# EAGLE design riscurino-1.0 (EAGLE 7.7.0)

## Sheet 1 of 2
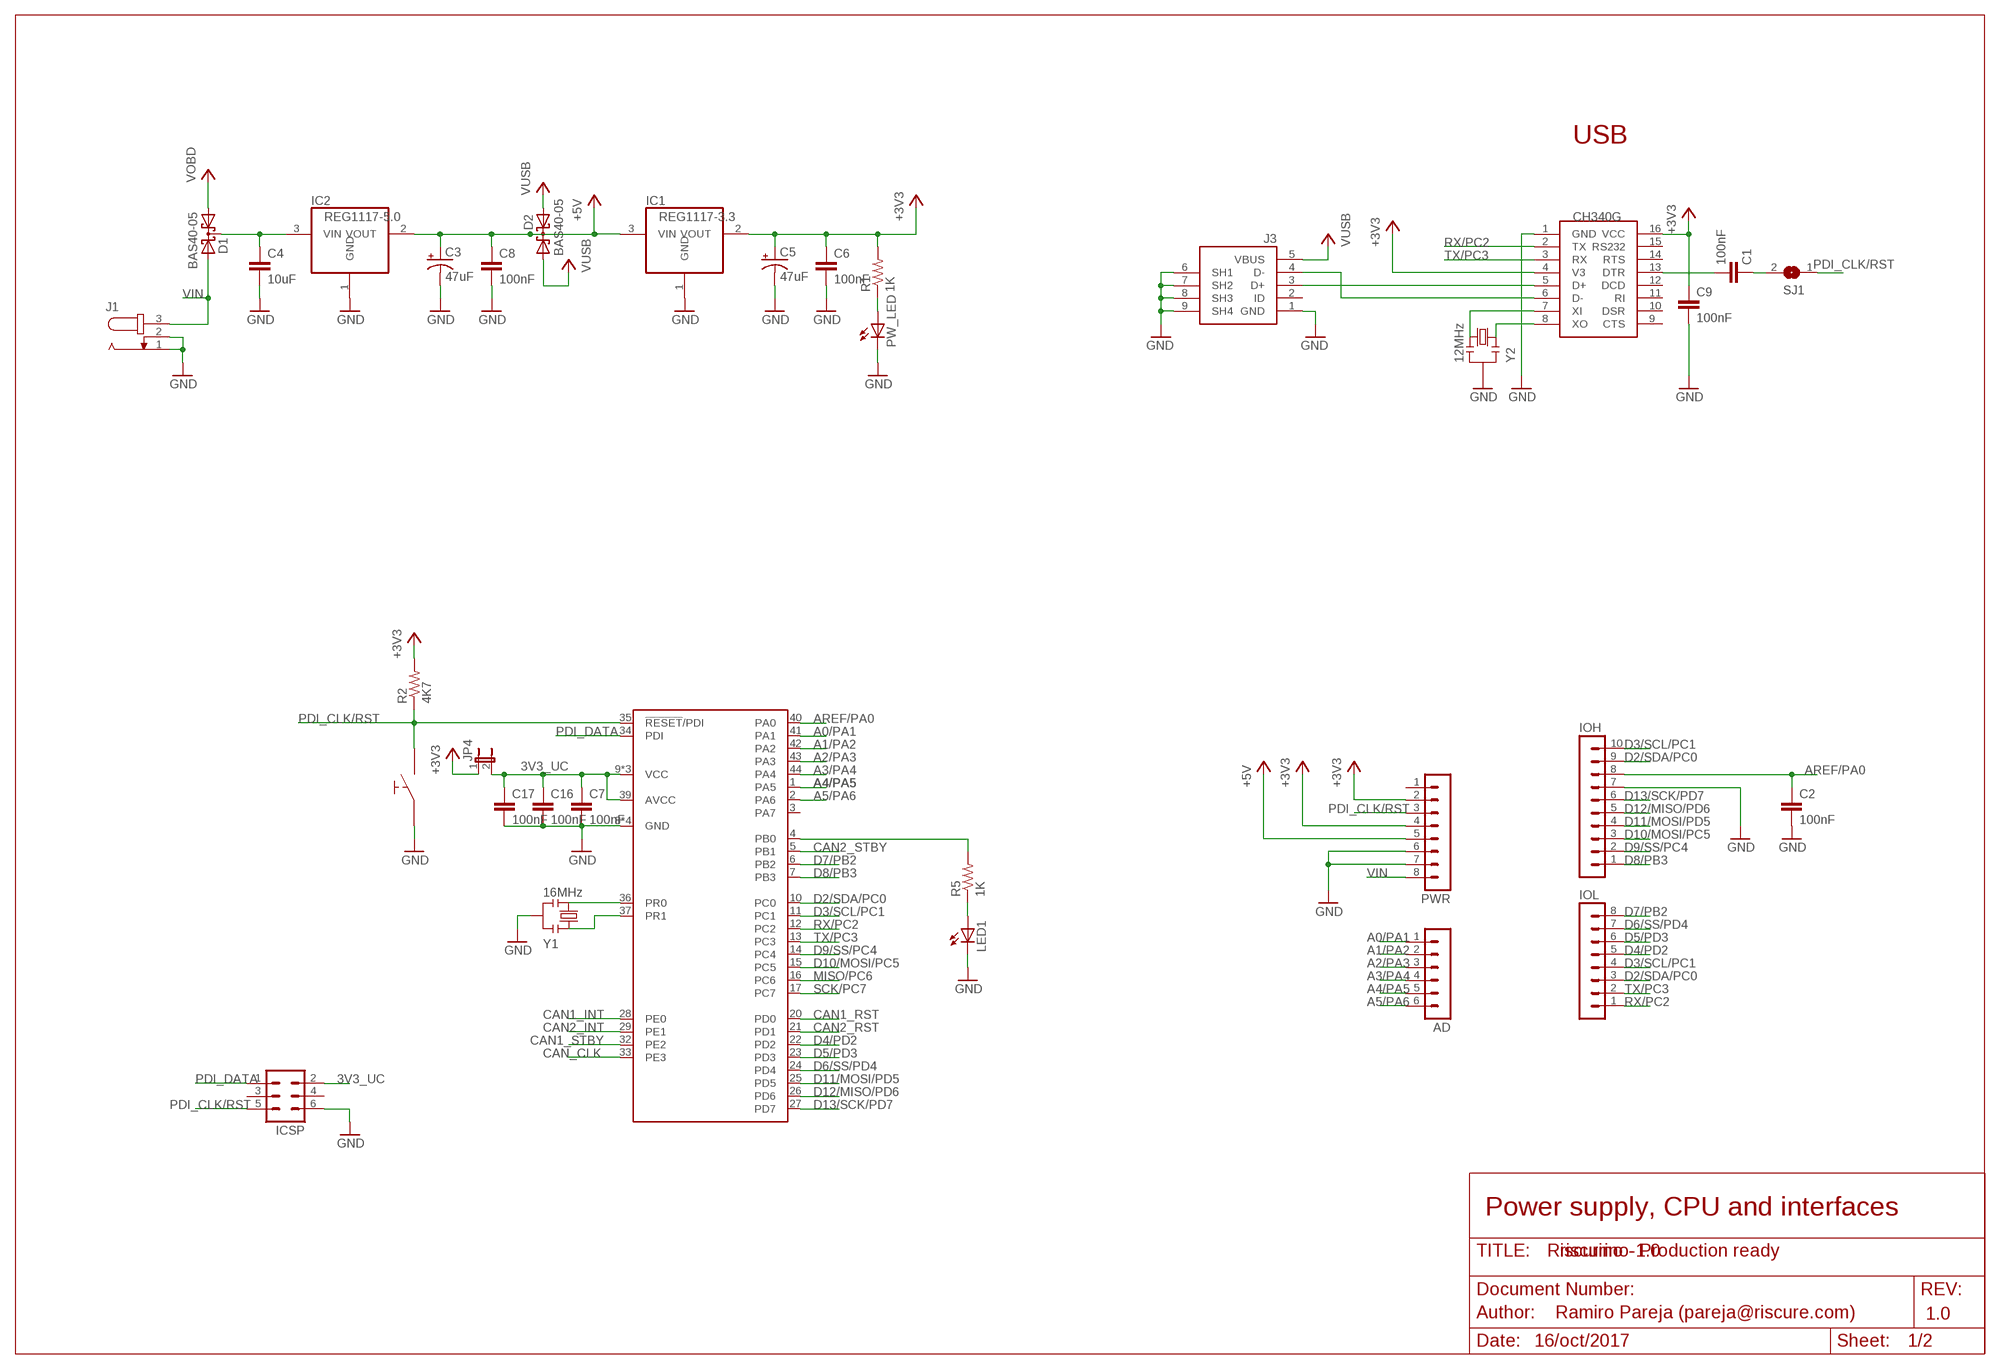
[diagram p0: schematic, sheet 1]

### Parts
AD  MA06-1  [MA06-1]
C1  100nF  C-EUC0805  [C0805]
C2  100nF  C-EUC0805  [C0805]
C3  47uF  CPOL-USC  [PANASONIC_C]
C4  10uF  C-EUC0805  [C0805]
C5  47uF  CPOL-USC  [PANASONIC_C]
C6  100nF  C-EUC0805  [C0805]
C7  100nF  C-EUC0805  [C0805]
C8  100nF  C-EUC0805  [C0805]
C9  100nF  C-EUC0805  [C0805]
C16  100nF  C-EUC0805  [C0805]
C17  100nF  C-EUC0805  [C0805]
D1  BAS40-05  [SOT23]
D2  BAS40-05  [SOT23]
IC1  REG1117-3.3  REG1117  [SOT223]
IC2  REG1117-5.0  REG1117  [SOT223]
ICSP  MA03-2  [MA03-2]
IOH  MA10-1  [MA10-1]
IOL  MA08-1  [MA08-1]
J1  JACK-PLUG0  [SPC4077]
J3  0219_14850  [USB-MINI-B_2]
JP4  JP1E  [JP1]
LED1  LEDCHIPLED_0805  [CHIPLED_0805]
PW_LED  LEDCHIPLED_0805  [CHIPLED_0805]
PWR  MA08-1  [MA08-1]
R1  1K  R-US_R0805  [R0805]
R2  4K7  R-US_R0805  [R0805]
R5  1K  R-US_R0805  [R0805]
SJ1  SJ  [SJ]
U1  ATXMEGA128A4U-AU  [TQFP-44A-44]
U4  CH340G  [SOIC16]
U$1  SWITCH_3X6_BIG  [SWITCH_3X6_BIG]
Y1  16MHz  0011_CSTCE16M0V53-R0  [RESONATOR]
Y2  12MHz  0011_CSTCE16M0V53-R0  [RESONATOR]

### Nets
3V3_UC: C7.1 C16.1 C17.1 ICSP.2 JP4.2 U1.9(VCC) U1.19(VCC) U1.31(VCC) U1.39(AVCC)
+3V3: C5.+ C6.1 C9.1 IC1.2(VOUT) JP4.1 PWR.2 PWR.4 R1.2 R2.2 U4.4(V3) U4.16(VCC) ; also sheet 2
+5V: C3.+ C8.1 D2.3(C) IC1.3(VIN) IC2.2(VOUT) PWR.5 ; also sheet 2
A0/PA1: AD.1 U1.41(PA1)
A1/PA2: AD.2 U1.42(PA2)
A2/PA3: AD.3 U1.43(PA3)
A3/PA4: AD.4 U1.44(PA4)
A4/PA5: AD.5 U1.1(PA5)
A5/PA6: AD.6 U1.2(PA6)
AREF/PA0: C2.1 IOH.8 U1.40(PA0)
CAN1_INT: U1.28(PE0) ; also sheet 2
CAN1_RST: U1.20(PD0) ; also sheet 2
CAN1_STBY: U1.32(PE2) ; also sheet 2
CAN2_INT: U1.29(PE1) ; also sheet 2
CAN2_RST: U1.21(PD1) ; also sheet 2
CAN2_STBY: U1.5(PB1) ; also sheet 2
CAN_CLK: U1.33(PE3) ; also sheet 2
D2/SDA/PC0: IOH.9 IOL.3 U1.10(PC0)
D3/SCL/PC1: IOH.10 IOL.4 U1.11(PC1)
D4/PD2: IOL.5 U1.22(PD2)
D5/PD3: IOL.6 U1.23(PD3)
D6/SS/PD4: IOL.7 U1.24(PD4) ; also sheet 2
D7/PB2: IOL.8 U1.6(PB2)
D8/PB3: IOH.1 U1.7(PB3)
D9/SS/PC4: IOH.2 U1.14(PC4) ; also sheet 2
D10/MOSI/PC5: IOH.3 U1.15(PC5) ; also sheet 2
D11/MOSI/PD5: IOH.4 U1.25(PD5) ; also sheet 2
D12/MISO/PD6: IOH.5 U1.26(PD6) ; also sheet 2
D13/SCK/PD7: IOH.6 U1.27(PD7) ; also sheet 2
GND: C2.2 C3.- C4.2 C5.- C6.2 C7.2 C8.2 C9.2 C16.2 C17.2 IC1.1(GND) IC2.1(GND) ICSP.6 IOH.7 J1.1 J1.2 J3.1(GND) J3.6(SH1) J3.7(SH2) J3.8(SH3) J3.9(SH4) LED1.C PW_LED.C PWR.6 PWR.7 U1.8(GND) U1.18(GND) U1.30(GND) U1.38(GND) U4.1(GND) U$1.P$1 Y1.2 Y2.2 ; also sheet 2
MISO/PC6: U1.16(PC6) ; also sheet 2
N$1: U1.36(PR0) Y1.3
N$2: U1.37(PR1) Y1.1
N$3: C1.2 U4.13(DTR)
N$4: C4.1 D1.3(C) IC2.3(VIN)
N$5: J3.3(D+) U4.5(D+)
N$7: PW_LED.A R1.1
N$8: J3.4(D-) U4.6(D-)
N$11: LED1.A R5.1
N$13: C1.1 SJ1.2
N$14: U4.8(XO) Y2.1
N$15: U4.7(XI) Y2.3
N$18: R5.2 U1.4(PB0)
PDI_CLK/RST: ICSP.5 PWR.3 R2.1 SJ1.1 U1.35(!RESET!/PDI) U$1.P$2
PDI_DATA: ICSP.1 U1.34(PDI)
RX/PC2: IOL.1 U1.12(PC2) U4.2(TX)
SCK/PC7: U1.17(PC7) ; also sheet 2
TX/PC3: IOL.2 U1.13(PC3) U4.3(RX)
VIN: D1.2(A2) J1.3 PWR.8
VOBD: D1.1(A1) ; also sheet 2
VUSB: D2.1(A1) D2.2(A2) J3.5(VBUS)
Unconnected: ICSP.3 ICSP.4 J3.2(ID) PWR.1 U1.3(PA7) U4.9(CTS) U4.10(DSR) U4.11(RI) U4.12(DCD) U4.14(RTS) U4.15(RS232)

### Notes on the sheet
- USB
- Power supply, CPU and interfaces
- Riscurino - Production ready
- Author:    Ramiro Pareja (pareja@riscure.com) | 1.0
- 16/oct/2017

## Sheet 2 of 2
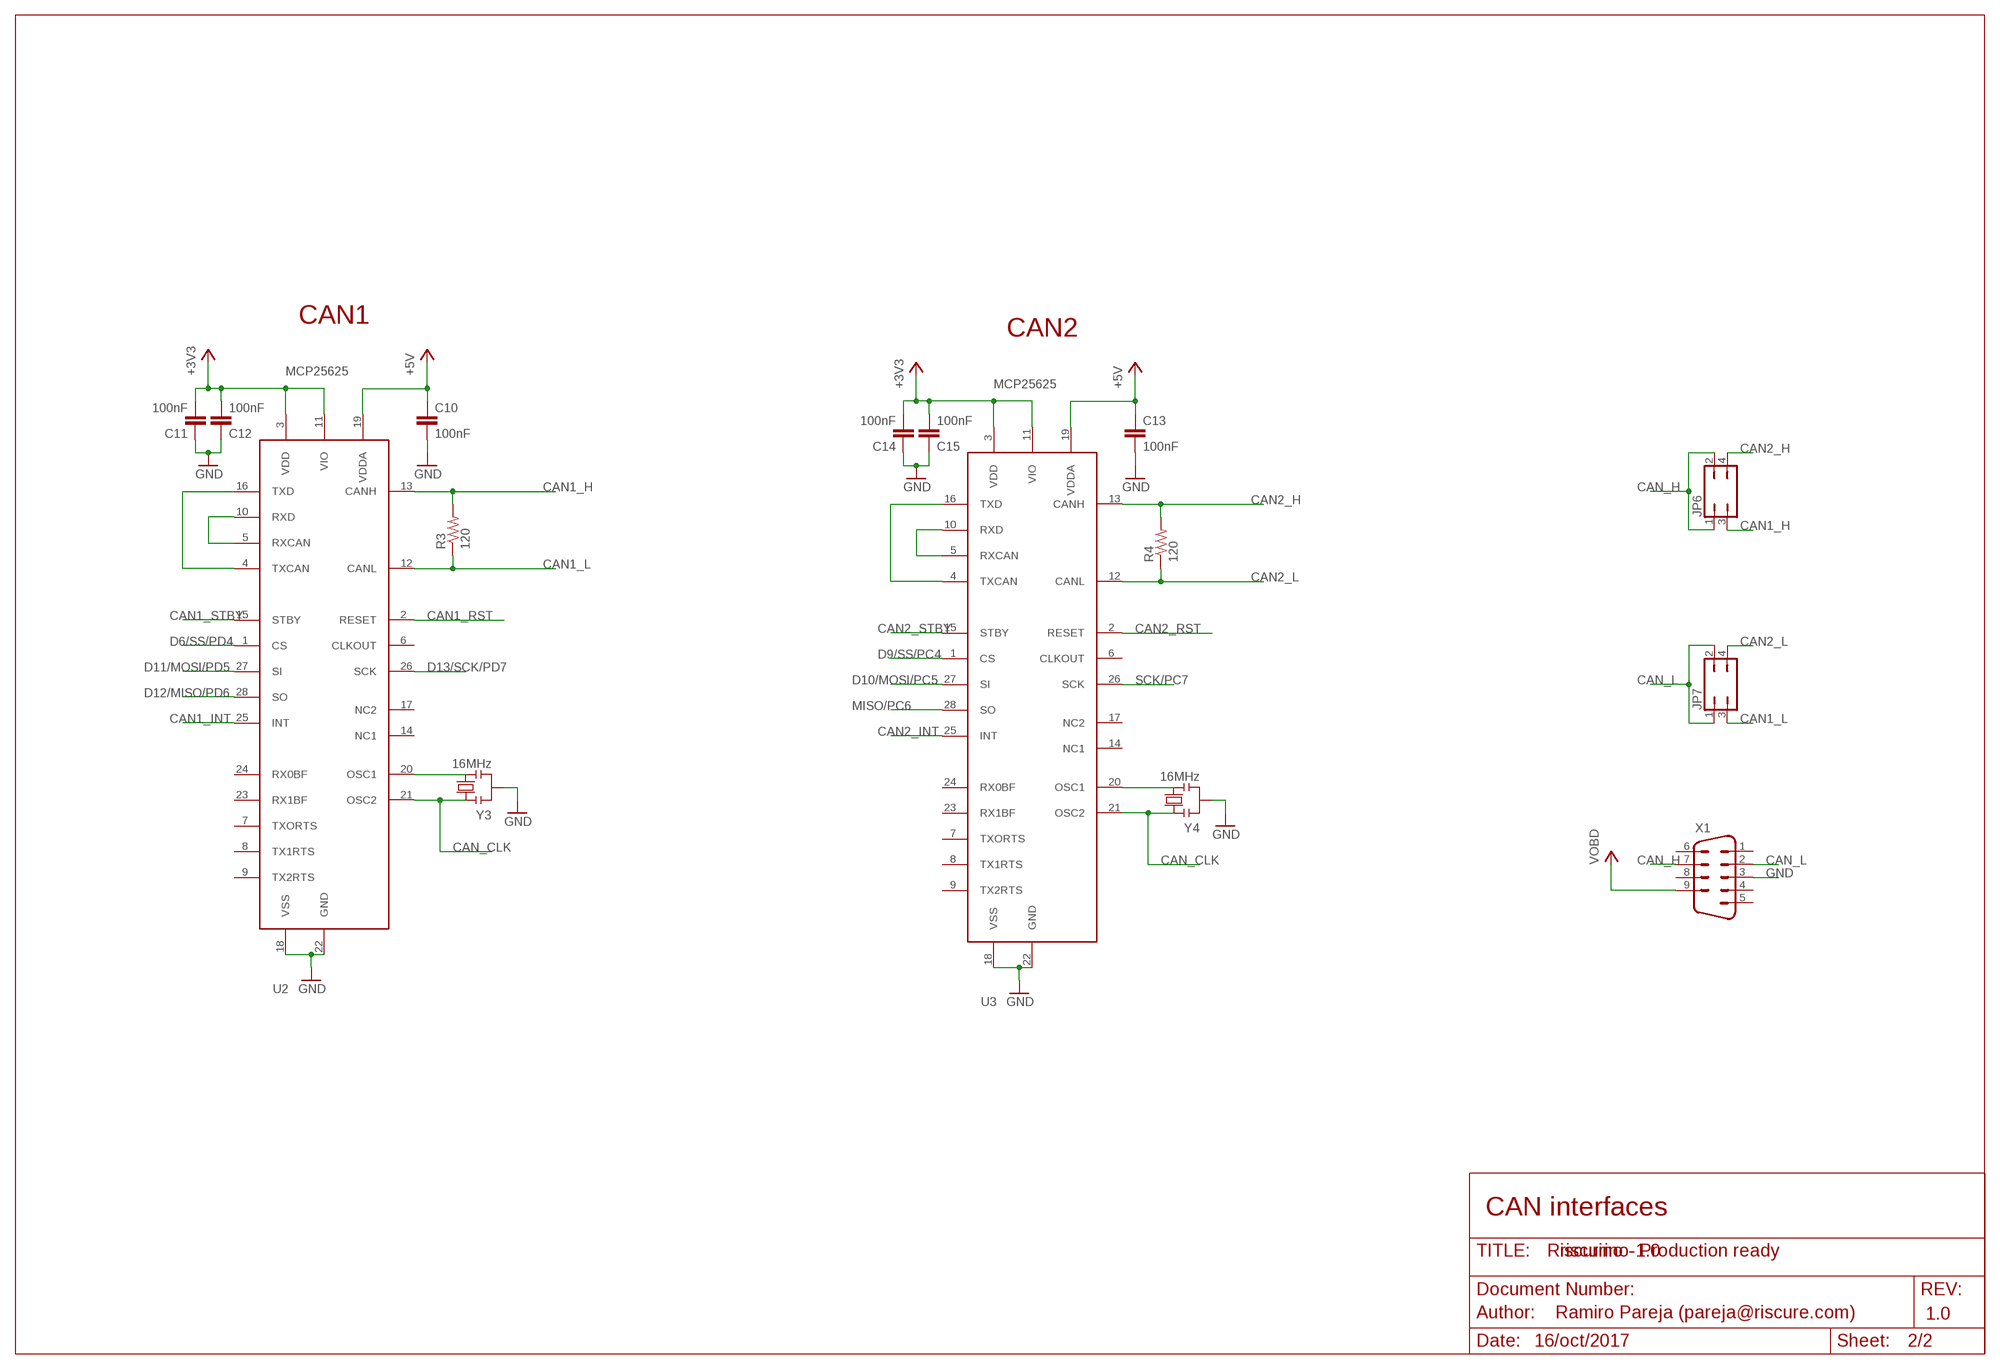
[diagram p1: schematic, sheet 2]

### Parts
C10  100nF  C-EUC0805  [C0805]
C11  100nF  C-EUC0805  [C0805]
C12  100nF  C-EUC0805  [C0805]
C13  100nF  C-EUC0805  [C0805]
C14  100nF  C-EUC0805  [C0805]
C15  100nF  C-EUC0805  [C0805]
JP6  JP2Q  [JP2Q]
JP7  JP2Q  [JP2Q]
R3  120  R-US_R0805  [R0805]
R4  120  R-US_R0805  [R0805]
U2  MCP25625  [QFN28]
U3  MCP25625  [QFN28]
X1  M09HP  [M09HP]
Y3  16MHz  0011_CSTCE16M0V53-R0  [RESONATOR]
Y4  16MHz  0011_CSTCE16M0V53-R0  [RESONATOR]

### Nets
+3V3: C11.2 C12.2 C14.2 C15.2 U2.3(VDD) U2.11(VIO) U3.3(VDD) U3.11(VIO) ; also sheet 1
+5V: C10.1 C13.1 U2.19(VDDA) U3.19(VDDA) ; also sheet 1
CAN1_H: JP6.3 R3.2 U2.13(CANH)
CAN1_INT: U2.25(INT) ; also sheet 1
CAN1_L: JP7.3 R3.1 U2.12(CANL)
CAN1_RST: U2.2(RESET) ; also sheet 1
CAN1_STBY: U2.15(STBY) ; also sheet 1
CAN2_H: JP6.4 R4.2 U3.13(CANH)
CAN2_INT: U3.25(INT) ; also sheet 1
CAN2_L: JP7.4 R4.1 U3.12(CANL)
CAN2_RST: U3.2(RESET) ; also sheet 1
CAN2_STBY: U3.15(STBY) ; also sheet 1
CAN_CLK: U2.21(OSC2) U3.21(OSC2) Y3.1 Y4.1 ; also sheet 1
CAN_H: JP6.1 JP6.2 X1.7
CAN_L: JP7.1 JP7.2 X1.2
D6/SS/PD4: U2.1(CS) ; also sheet 1
D9/SS/PC4: U3.1(CS) ; also sheet 1
D10/MOSI/PC5: U3.27(SI) ; also sheet 1
D11/MOSI/PD5: U2.27(SI) ; also sheet 1
D12/MISO/PD6: U2.28(SO) ; also sheet 1
D13/SCK/PD7: U2.26(SCK) ; also sheet 1
GND: C10.2 C11.1 C12.1 C13.2 C14.1 C15.1 U2.18(VSS) U2.22(GND) U3.18(VSS) U3.22(GND) X1.3 Y3.2 Y4.2 ; also sheet 1
MISO/PC6: U3.28(SO) ; also sheet 1
N$6: U3.4(TXCAN) U3.16(TXD)
N$9: U2.4(TXCAN) U2.16(TXD)
N$10: U2.5(RXCAN) U2.10(RXD)
N$12: U3.5(RXCAN) U3.10(RXD)
N$16: U2.20(OSC1) Y3.3
N$17: U3.20(OSC1) Y4.3
SCK/PC7: U3.26(SCK) ; also sheet 1
VOBD: X1.9 ; also sheet 1
Unconnected: U2.6(CLKOUT) U2.7(TXORTS) U2.8(TX1RTS) U2.9(TX2RTS) U2.14(NC1) U2.17(NC2) U2.23(RX1BF) U2.24(RX0BF) U3.6(CLKOUT) U3.7(TXORTS) U3.8(TX1RTS) U3.9(TX2RTS) U3.14(NC1) U3.17(NC2) U3.23(RX1BF) U3.24(RX0BF) X1.1 X1.4 X1.5 X1.6 X1.8

### Notes on the sheet
- CAN1
- CAN2
- CAN interfaces
- Riscurino - Production ready
- Author:    Ramiro Pareja (pareja@riscure.com) | 1.0
- 16/oct/2017

## Library data of the parts
AD = con-lstb:MA06-1: PIN HEADER; OC_FARNELL: unknown; OC_NEWARK: unknown
C1 C2 C4 C6-C17 = rcl:C-EU: CAPACITOR, European symbol
C3 C5 = rcl:CPOL-US: POLARIZED CAPACITOR, American symbol
D1 D2 = diode:BAS40-05: Silicon Schottky Diodes General-purpose diode for high-speed switching
IC1 IC2 = burr-brown:REG1117: 800mA and 1A Low Dropout (LDO) Positive Regulator 1.8V, 2.5V, 2.85V, 3.3V, 5V, and Adj; MPN: REG1117; OC_FARNELL: 1097566; OC_NEWARK: 14P6981
ICSP = con-lstb:MA03-2: PIN HEADER; OC_FARNELL: unknown; OC_NEWARK: unknown
IOH = con-lstb:MA10-1: PIN HEADER; OC_FARNELL: unknown; OC_NEWARK: unknown
IOL PWR = con-lstb:MA08-1: PIN HEADER; OC_FARNELL: unknown; OC_NEWARK: unknown
J1 = con-jack:JACK-PLUG: DC POWER JACK Power Jack, DC, Right Angle, Through Hole, Rated 5A at 16VDC, PC Terminals Distributor: Farnell (www.Farnell.de) Drawing: 84N1161.pdf / 84N1162.pdf Manufacturer: SPC Technology (www.spctechnology.com) Type: SPC4077 / SPC 4078; OC_FARNELL: unknown; OC_NEWARK: unknown
J3 = Connettori:0219_14850: Usb-Mini F 90 Smd; MONTHLY_USAGE: _____; PART_NUMBER: 14850; PRICE: _____; SUPPLIER: _____; TYPE: Connettori; VALUE: USB-mini-90 -SMD
JP4 = jumper:JP1E: JUMPER
JP6 JP7 = jumper:JP2Q: JUMPER
LED1 PW_LED = led:LED: LED OSRAM: - CHIPLED LG R971, LG N971, LY N971, LG Q971, LY Q971, LO R971, LY R971 LH N974, LH R974 LS Q976, LO Q976, LY Q976 LO Q996 - Hyper CHIPLED LW Q18S LB Q993, LB Q99A, LB R99A - SideLED LS A670, LO A670, LY A670, LG A670, LP A670 LB A673, LV A673, LT A673, LW A673 LH A674 LY A675 LS A676, LA A676, LO A676, LY A676, LW A676 LS A679, LY A679, LG A679 - Hyper Micro SIDELED® LS Y876, LA Y876, LO Y876, LY Y876 LT Y87S - SmartLED LW L88C, LW L88S LB L89C, LB L89S, LG L890 LS L89K, LO L89K, LY L89K LS L896, LA L896, LO L896, LY L896 - TOPLED LS T670, LO T670, LY T670, LG T670, LP T670 LSG T670, LSP T670, LSY T670, LOP T670, LYG T670 LG T671, LOG T671, LSG T671 LB T673, LV T673, LT T673, LW T673 LH T674 LS T676, LA T676, LO T676, LY T676, LB T676, LH T676, LSB T676, LW T676 LB T67C, LV T67C, LT T67C, LS T67K, LO T67K, LY T67K, LW E67C LS E67B, LA E67B, LO E67B, LY E67B, LB E67C, LV E67C, LT E67C LW T67C LS T679, LY T679, LG T679 LS T770, LO T770, LY T770, LG T770, LP T770 LB T773, LV T773, LT T773, LW T773 LH T774 LS E675, LA E675, LY E675, LS T675 LS T776, LA T776, LO T776, LY T776, LB T776 LHGB T686 LT T68C, LB T68C - Hyper Mini TOPLED® LB M676 - Mini TOPLED Santana® LG M470 LS M47K, LO M47K, LY M47K Source: http://www.osram.convergy.de LUXEON: - LUMILED® LXK2-PW12-R00, LXK2-PW12-S00, LXK2-PW14-U00, LXK2-PW14-V00 LXK2-PM12-R00, LXK2-PM12-S00, LXK2-PM14-U00 LXK2-PE12-Q00, LXK2-PE12-R00, LXK2-PE12-S00, LXK2-PE14-T00, LXK2-PE14-U00 LXK2-PB12-K00, LXK2-PB12-L00, LXK2-PB12-M00, LXK2-PB14-N00, LXK2-PB14-P00, LXK2-PB14-Q00 LXK2-PR12-L00, LXK2-PR12-M00, LXK2-PR14-Q00, LXK2-PR14-R00 LXK2-PD12-Q00, LXK2-PD12-R00, LXK2-PD12-S00 LXK2-PH12-R00, LXK2-PH12-S00 LXK2-PL12-P00, LXK2-PL12-Q00, LXK2-PL12-R00 Source: www.luxeon.com KINGBRIGHT: KA-3528ASYC Source: www.kingbright.com
R1-R5 = rcl:R-US_: RESISTOR, American symbol
SJ1 = jumper:SJ: SMD solder JUMPER
U1 = atmel-xmega:ATXMEGA128A4U: 8/16-bit XMEGA A4U Microcontroller Features High-performance, low-power Atmel® AVR® XMEGA® 8/16-bit Microcontroller Nonvolatile program and data memories – 16K - 128KBytes of in-system self-programmable flash – 4K - 8KBytes boot section – 1K - 2KBytes EEPROM – 2K - 8KBytes internal SRAM Peripheral Features – Four-channel DMA controller – Eight-channel event system – Five 16-bit timer/counters Three timer/counters with 4 output compare or input capture channels Two timer/counters with 2 output compare or input capture channels High-resolution extensions on all timer/counters Advanced waveform extension (AWeX) on one timer/counter – One USB device interface USB 2.0 full speed (12Mbps) and low speed (1.5Mbps) device compliant 32 Endpoints with full configuration flexibility – Five USARTs with IrDA support for one USART – Two Two-wire interfaces with dual address match (I2C and SMBus compatible) – Two serial peripheral interfaces (SPIs) – AES and DES crypto engine – CRC-16 (CRC-CCITT) and CRC-32 (IEEE® 802.3) generator – 16-bit real time counter (RTC) with separate oscillator – One twelve-channel, 12-bit, 2mspsAnalog to Digital Converter – One two-channel, 12-bit, 1msps Digital to Analog Converter – Two Analog Comparators with window compare function, and current sources – External interrupts on all general purpose I/O pins – Programmable watchdog timer with separate on-chip ultra low power oscillator – QTouch® library support Capacitive touch buttons, sliders and wheels Special microcontroller features – Power-on reset and programmable brown-out detection – Internal and external clock options with PLL and prescaler – Programmable multilevel interrupt controller – Five sleep modes – Programming and debug interfaces PDI (program and debug interface) I/O and packages – 34 Programmable I/O pins – 44 - lead TQFP – 44 - pad VQFN/QFN – 49 - ball VFBGA Operating voltage – 1.6 – 3.6V Operating frequency – 0 – 12MHz from 1.6V – 0 – 32MHz from 2.7V
U2 U3 = MCP25625-fixed:MCP25625
U4 = ch340g:CH340G
U$1 = riscurino:SWITCH_3X6_BIG
X1 = con-subd:M09: SUB-D; OC_FARNELL: unknown; OC_NEWARK: unknown
Y1-Y4 = Cristalli:0011_CSTCE16M0V53-R0: 16Mhz - SMD; MONTHLY_USAGE: _____; PART_NUMBER: CSTCE16M0V53-R0; PRICE: _____; SUPPLIER: _____; TYPE: Cristalli; VALUE: CSTCE16M0V53-R0

## Board
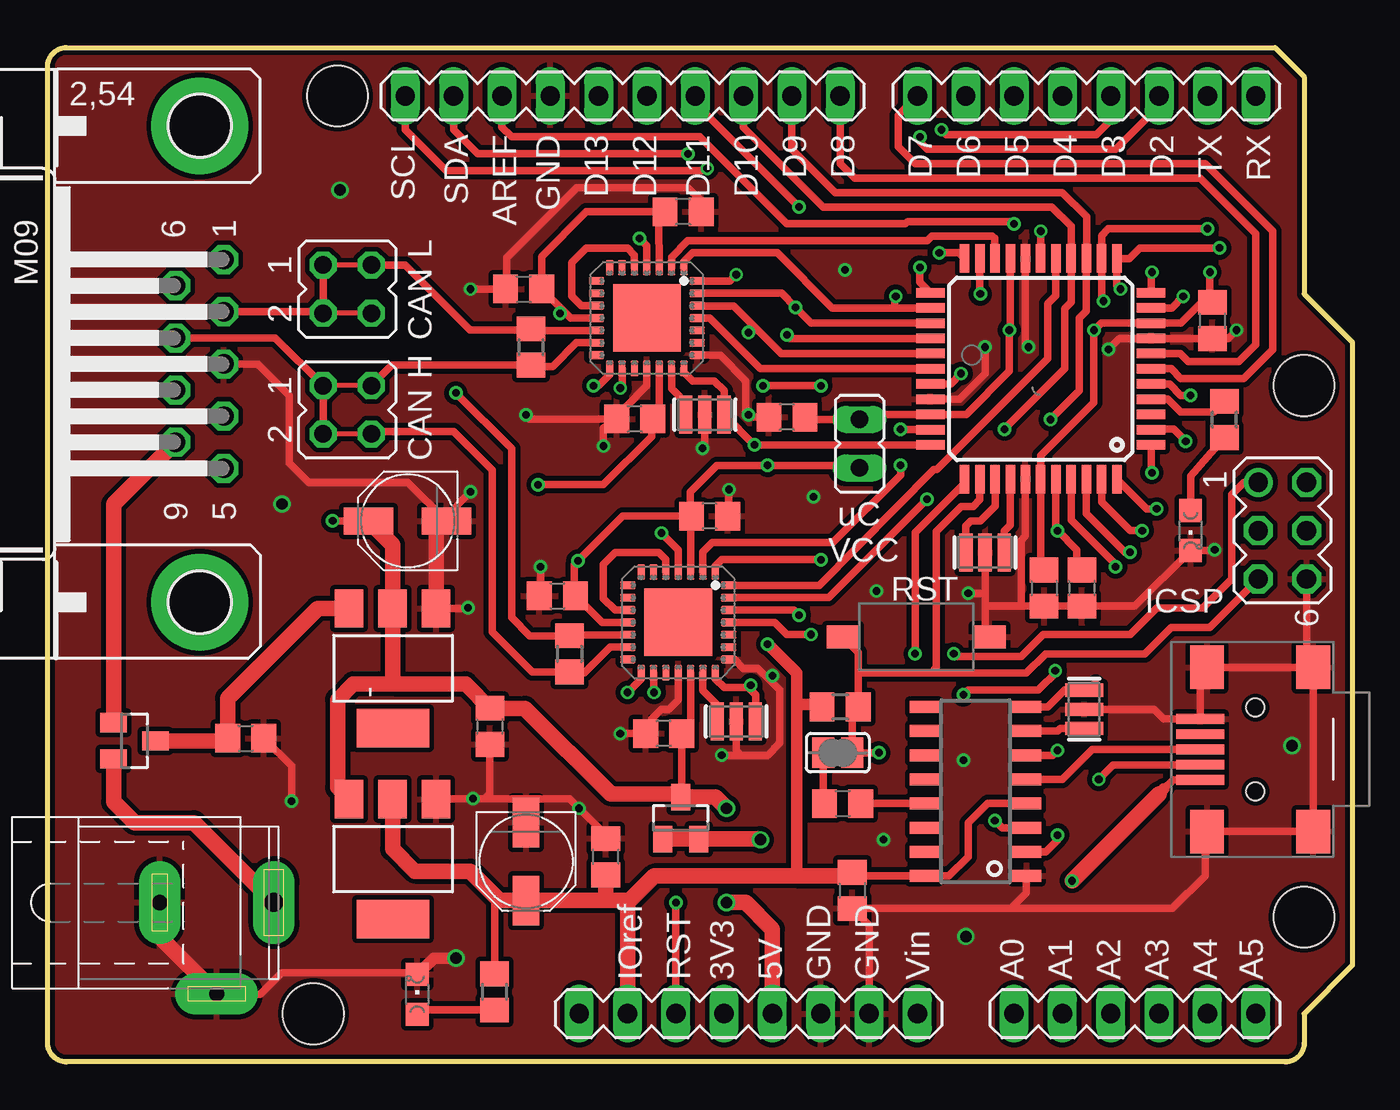
[diagram p2: board, top side]
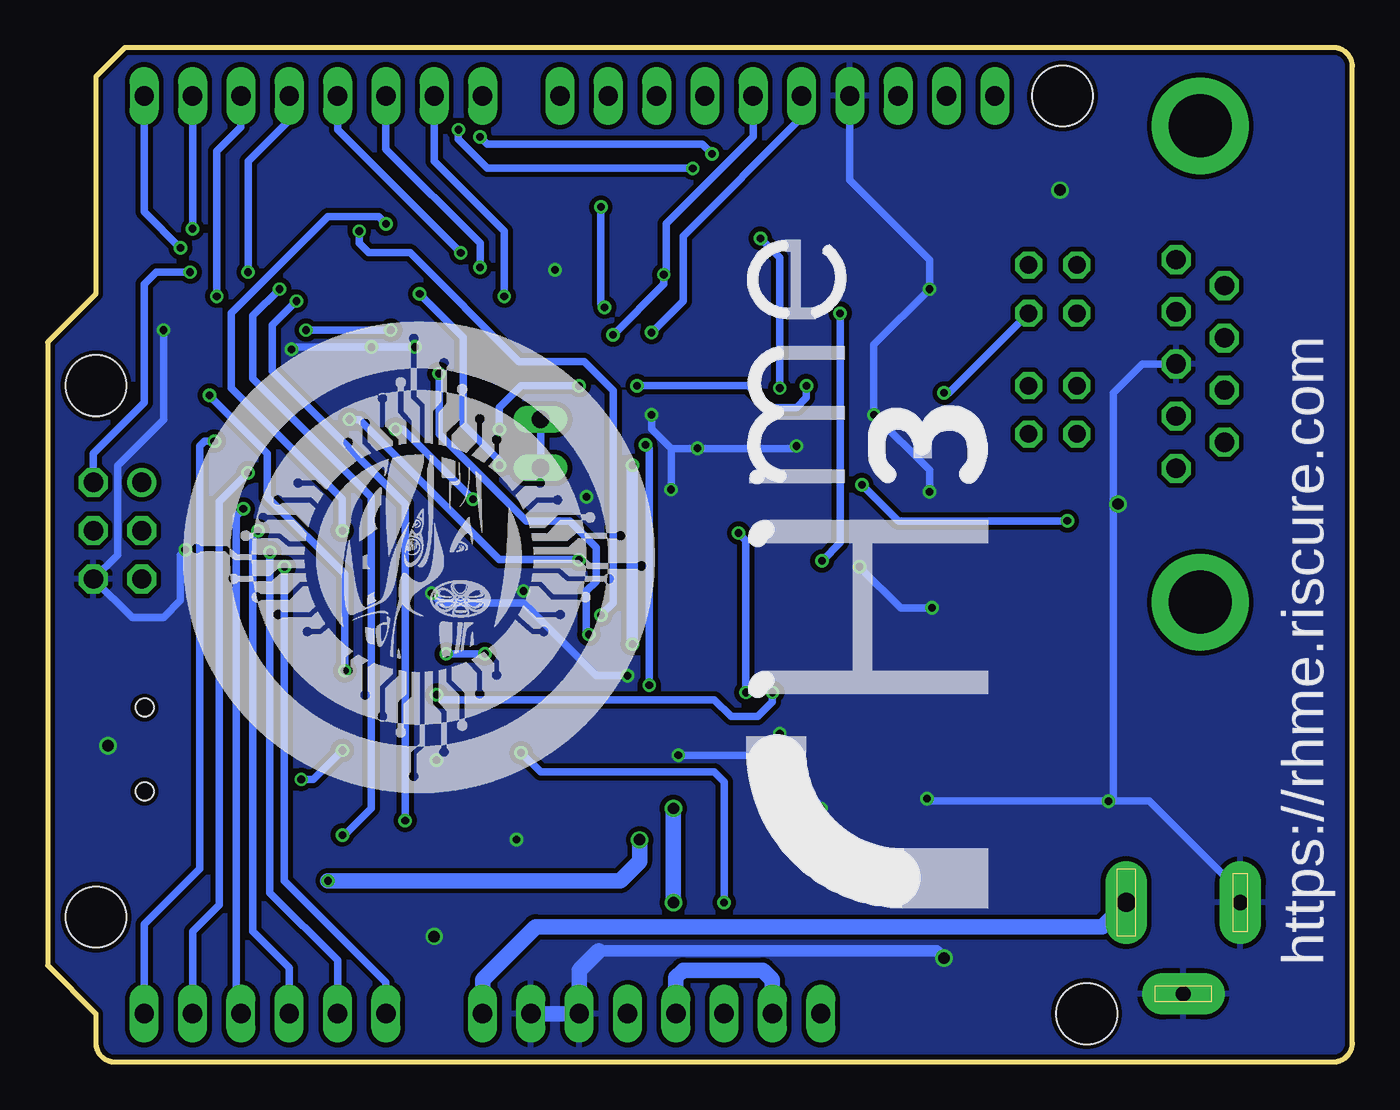
[diagram p3: board, bottom side, seen from below]

Size 68.58 x 53.34 mm. Coordinates in mm from the lower left corner, seen from the top.
Outline: 64.52,53.34 66.04,51.82 66.04,40.39 68.58,37.85 68.58,5.08 66.04,2.54 66.04,1 arc-90 65.04,0 1,0 arc-90 0,1 0,52.34 arc-90 1,53.34 64.52,53.34
Copper layers (1*16): Top 0.035mm / dielectric 1.5mm / Bottom 0.035mm
Design rules "ITEADstudio_DRC *": minimum track width 8mil, minimum drill 0.4mm, track to track 8mil, track to pad 8mil, pad to pad 8mil, via to via 8mil, smd to smd 0mil, copper to edge 10mil, drill to drill 10mil, minimum pad ring 10mil, minimum via ring 6mil, stop-mask expansion 2mil, vias tented up to drill 100mil, thermal gap 10mil
Holes 3.2 mm at 66.04,35.56 66.04,7.62 15.24,50.8 13.97,2.54

### Footprints (pad centres in the part's own frame; a part is rotated, then mirrored left to right if it is on the bottom)
MA06-1 = drill 1.016 long: 1 -6.35,0; 2 -3.81,0; 3 -1.27,0; 4 1.27,0; 5 3.81,0; 6 6.35,0
C0805 = smd 1.3 x 1.5: 1 -0.95,0; 2 0.95,0
PANASONIC_C = smd 2.6 x 1.4: + 2.05,0; - -2.05,0
SOT23 = smd 1 x 1.4: 1 -0.95,-1.1; 2 0.95,-1.1; 3 0,1.1
SOT223 = smd 1.499 x 2.007: 1 -2.261,-3.15; 2 0.025,-3.15; 3 2.311,-3.15 | smd 3.81 x 2.007: 4 0,3.15
MA03-2 = drill 1.016: 1 -2.54,-1.27 | drill 1.016 octagon: 2 -2.54,1.27; 3 0,-1.27; 4 0,1.27; 5 2.54,-1.27; 6 2.54,1.27
MA10-1 = drill 1.016 long: 1 -11.43,0; 2 -8.89,0; 3 -6.35,0; 4 -3.81,0; 5 -1.27,0; 6 1.27,0; 7 3.81,0; 8 6.35,0; 9 8.89,0; 10 11.43,0
MA08-1 = drill 1.016 long: 1 -8.89,0; 2 -6.35,0; 3 -3.81,0; 4 -1.27,0; 5 1.27,0; 6 3.81,0; 7 6.35,0; 8 8.89,0
SPC4077 = drill 0.8 pad 2.184 long: 1 -3,0; 2 0,-4.8 | drill 1 pad 2.184 long: 3 3,0
USB-MINI-B_2 = smd 0.508 x 2.54: 1 0,0; 2 0.8,0; 3 1.6,0; 4 2.4,0; 5 3.2,0 | smd 2.286 x 1.778: 6 -2.717,5.948; 7 -2.717,0.36; 8 5.918,0.36; 9 5.918,5.948 | hole 0.95: -0.6,2.9; 3.8,2.9
JP1 = drill 0.914 long: 1 0,-1.27; 2 0,1.27
JP2Q = drill 0.914 octagon: 1 -1.27,-1.27; 2 1.27,-1.27; 3 -1.27,1.27; 4 1.27,1.27
CHIPLED_0805 = smd 1.2 x 1.2: A 0,-1.05; C 0,1.05
R0805 = smd 1.3 x 1.5: 1 -0.95,0; 2 0.95,0
SJ = smd 1.168 x 1.6: 1 -0.762,0; 2 0.762,0
TQFP-44A-44 = smd 1.5 x 0.5: 1 -5.8,4; 2 -5.8,3.2; 3 -5.8,2.4; 4 -5.8,1.6; 5 -5.8,0.8; 6 -5.8,0; 7 -5.8,-0.8; 8 -5.8,-1.6; 9 -5.8,-2.4; 10 -5.8,-3.2; 11 -5.8,-4; 23 5.8,-4; 24 5.8,-3.2; 25 5.8,-2.4; 26 5.8,-1.6; 27 5.8,-0.8; 28 5.8,0; 29 5.8,0.8; 30 5.8,1.6; 31 5.8,2.4; 32 5.8,3.2; 33 5.8,4 | smd 0.5 x 1.5: 12 -4,-5.8; 13 -3.2,-5.8; 14 -2.4,-5.8; 15 -1.6,-5.8; 16 -0.8,-5.8; 17 0,-5.8; 18 0.8,-5.8; 19 1.6,-5.8; 20 2.4,-5.8; 21 3.2,-5.8; 22 4,-5.8; 34 4,5.8; 35 3.2,5.8; 36 2.4,5.8; 37 1.6,5.8; 38 0.8,5.8; 39 0,5.8; 40 -0.8,5.8; 41 -1.6,5.8; 42 -2.4,5.8; 43 -3.2,5.8; 44 -4,5.8
QFN28 = smd 0.8 x 0.4: 1 -2.65,1.95; 2 -2.65,1.3; 3 -2.65,0.65; 4 -2.65,0; 5 -2.65,-0.65; 6 -2.65,-1.3; 7 -2.65,-1.95; 15 2.65,-1.95; 16 2.65,-1.3; 17 2.65,-0.65; 18 2.65,0; 19 2.65,0.65; 20 2.65,1.3; 21 2.65,1.95 | smd 0.4 x 0.8: 8 -1.95,-2.65; 9 -1.3,-2.65; 10 -0.65,-2.65; 11 0,-2.65; 12 0.65,-2.65; 13 1.3,-2.65; 14 1.95,-2.65; 22 1.95,2.65; 23 1.3,2.65; 24 0.65,2.65; 25 0,2.65; 26 -0.65,2.65; 27 -1.3,2.65; 28 -1.95,2.65 | smd 3.55 x 3.55: M 0,0
SOIC16 = smd 0.635 x 1.524: 1 -4.445,-2.695; 2 -3.175,-2.695; 3 -1.905,-2.695; 4 -0.635,-2.695; 5 0.635,-2.695; 6 1.905,-2.695; 7 3.175,-2.695; 8 4.445,-2.695; 9 4.445,2.695; 10 3.175,2.695; 11 1.905,2.695; 12 0.635,2.695; 13 -0.635,2.695; 14 -1.905,2.695; 15 -3.175,2.695; 16 -4.445,2.695
SWITCH_3X6_BIG = smd 1.7 x 1.2: P$1 -3.91,0; P$2 3.79,0
M09HP = drill 1.016 octagon: 1 -5.486,1.27; 2 -2.743,1.27; 3 0,1.27; 4 2.743,1.27; 5 5.486,1.27; 6 -4.115,-1.27; 7 -1.372,-1.27; 8 1.372,-1.27; 9 4.115,-1.27 | drill 3.302 pad 5.08: G1 -12.522,0; G2 12.522,0
RESONATOR = smd 0.7 x 2: 1 -1,0; 2 0,0; 3 1,0

### Placement (x,y rotation side)
AD  57.15,2.54 0 top
C1  41.78,13.59 0 top
C2  54.36,24.92 270 top
C3  18.92,28.45 180 top
C4  10.41,17.02 0 top
C5  25.15,10.54 270 top
C6  29.34,10.79 90 top
C7  61.21,38.99 270 top
C8  23.24,17.65 270 top
C9  42.29,9.02 270 top
C10  30.86,33.81 180 top
C11  25.02,40.64 0 top
C12  33.4,44.7 180 top
C13  32.38,17.27 180 top
C14  34.8,28.7 180 top
C15  26.8,24.51 0 top
C16  38.86,33.91 180 top
C17  52.37,24.92 270 top
D1  4.57,16.89 270 top
D2  33.27,12.83 0 top
IC1  18.16,10.67 180 top
IC2  18.16,20.7 180 top
ICSP  64.9,27.94 270 top
IOH  30.23,50.8 180 top
IOL  54.61,50.8 180 top
J1  8.89,8.38 0 top
J3  60.58,18.03 270 top
JP4  42.67,32.51 0 top
JP6  15.75,34.29 270 top
JP7  15.75,40.64 270 top
LED1  60.07,27.94 180 top
PW_LED  19.43,3.56 0 top
PWR  36.83,2.54 0 top
R1  23.5,3.68 90 top
R2  41.66,18.67 180 top
R3  25.4,37.59 270 top
R4  27.43,21.46 270 top
R5  61.85,33.78 90 top
SJ1  41.53,16.26 180 top
U1  52.2,36.45 180 top
U2  31.5,39.12 270 top
U3  33.15,23.11 270 top
U4  48.77,14.22 90 top
U$1  45.59,22.35 180 top
X1  8,36.7 270 top
Y1  49.28,26.8 180 top
Y2  54.48,18.54 270 top
Y3  34.54,34.04 180 top
Y4  36.2,17.91 180 top

### Tracks (layer width: path | path; a pad name or v marks a point on that pad's centre or on a via)
3V3_UC  (via drill 0.4)
  Top 0.406: C16.1 39.94,33.78 JP4.2 42.94,34.05 U1.31 48.27,34.05 50.55,36.32 v50.55,38.48 50.6,38.66 U1.19 | C17.1 52.2,26.48 U1.39 52.2,31.88 54.99,34.67 v54.99,38.48 55.38,38.85 U1.9 59.55,38.85 60.58,39.88 61.15,39.88 C7.1 61.09,40.07 v61.09,41.53
  Bottom 0.406: v54.99,38.48 v50.55,38.48 | ICSP.2 66.17,32 63.5,34.67 63.5,40.89 62.87,41.53 v61.09,41.53
+3V3  (via drill 0.4)
  Top 0.406: R1.2 23.5,8.26 23.75,8.51 | C9.1 42.48,9.78 U4.16 47.37,9.78 48.39,10.79 48.39,12.57 49.4,13.59 U4.4 | 28.07,39.12 U2.11 27.49,39.12 27.12,39.49 | U2.3 32.13,44.2 C12.2 28.32,44.7 25.97,42.35 C11.2 27.12,39.49 | U3.11 29.14,23.11 C15.2 27.69,24.57 27.69,26.16 v27.88,26.35 30.23,28.7 C14.2 | U3.3 33.8,28.65 C14.2 | 39.37,9.91 39.5,9.78 | C14.2 33.78,28.77 33.78,29.97 35.18,31.37 v37.85,31.37 42.67,31.37 JP4.1 | 27.12,39.49 27.05,39.49 v26.92,39.37
  Top 0.61: 39.37,9.91 39.37,18.8 | 39.37,18.8 39.37,20.45 v37.85,21.97 | 39.37,18.8 40.58,18.8 R2.2
  Top 0.813: IC1.2 18.14,11.2 19.3,10.03 22.23,10.03 23.75,8.51 25.13,8.51 C5.+ 29.46,8.49 | 29.46,8.49 30.61,8.49 | C9.1 42.1,9.78 39.5,9.78 31.89,9.78 30.61,8.49 | C6.1 29.34,8.62 29.46,8.49 | PWR.2 30.48,8.36 30.61,8.49
  Bottom 0.406: v26.92,39.37 26.92,27.3 v27.88,26.35 | JP4.1 42.67,33.78
  Bottom 0.61: v37.85,21.97 v37.85,31.37
  Bottom 0.813: PWR.4 35.56,4.45 35.18,4.83 30.99,4.83 30.48,4.32 PWR.2
+5V  (via drill 0.4, 0.6)
  Top 0.406: U2.19 32.15,34.57 C10.1 31.75,33.84 31.75,32.89 29.21,30.35 v25.78,30.35 | U3.19 33.8,17.98 C13.1 33.34,13.99 D2.3 | C3.+ v14.99,28.45
  Top 0.813: 18.22,19.88 18.14,19.96 | 18.22,19.88 18.03,19.88 | 18.03,19.88 16.07,19.88 15.24,19.05 15.24,14.43 IC1.3 | 18.22,19.88 21.97,19.88 C8.1 25.09,18.6 29.59,14.1 33.1,14.1 D2.3 35.09,13.93 v35.69,13.34 | C3.+ 18.14,27.18 IC2.2 18.14,19.98 18.03,19.88 | PWR.5 38.1,6.99 36.7,8.38 v35.69,8.38
  Bottom 0.406: v14.99,28.45 23.88,28.45 v25.78,30.35
  Bottom 0.813: v35.69,8.38 v35.69,13.34
A0/PA1  (via drill 0.4)
  Top 0.406: U1.41 53.8,28.5 56.13,26.16 v56.13,26.04
  Bottom 0.406: v56.13,26.04 56.13,9.53 50.8,4.19 AD.1
A1/PA2  (via drill 0.4)
  Top 0.406: U1.42 54.6,28.84 56.64,26.8 v56.9,26.8
  Bottom 0.406: v56.9,26.8 56.9,8.89 53.34,5.33 AD.2
A2/PA3  (via drill 0.4)
  Top 0.406: U1.43 55.4,29.44 56.9,27.94 v57.53,27.94
  Bottom 0.406: v57.53,27.94 57.78,27.69 57.78,6.86 55.88,4.95 AD.3
A3/PA4  (via drill 0.4)
  Top 0.406: U1.44 57.76,29.08 v58.29,29.08
  Bottom 0.406: v58.29,29.08 58.67,28.7 58.67,3.81 58.42,3.56 AD.4
A4/PA5  (via drill 0.4)
  Top 0.406: U1.1 58,31.03 v58.04,30.99
  Bottom 0.406: v58.04,30.99 59.56,29.46 59.56,8.26 60.96,6.86 AD.5
A5/PA6  (via drill 0.4)
  Top 0.406: U1.2 58.02,33.27 59.18,33.27 v59.82,32.64
  Bottom 0.406: AD.6 63.5,7.24 60.58,10.16 60.58,32.38 60.33,32.64 v59.82,32.64
AREF/PA0  (via drill 0.4)
  Top 0.406: U1.40 53,28.03 v53.09,27.94 54.1,26.92 54.1,26.35 C2.1 | IOH.8 23.88,49.15 24.38,48.64 34.29,48.64 38.86,44.07 45.09,44.07 45.21,44.2 50.67,44.2 v50.8,44.07
  Bottom 0.406: v53.09,27.94 53.09,29.59 58.93,35.43 58.93,39.37 53.85,44.45 51.18,44.45 v50.8,44.07
CAN1_H
  Top 0.254: JP6.3 14.48,35.56
  Top 0.406: U2.13 27.78,37.82 26.54,36.58 25.85,36.58 R3.2 | 25.71,36.58 R3.2 | JP6.3 18.1,36.64 R3.2
CAN1_INT
  Top 0.406: U2.25 34.8,39.12 37.47,36.45 U1.28
CAN1_L
  Top 0.254: JP7.3 14.48,41.91
  Top 0.406: U2.12 25.86,38.47 R3.1 25.72,38.48 22.23,38.48 18.8,41.91 JP7.3
CAN1_RST
  Top 0.406: U2.2 32.8,42.32 33.66,43.18 46.23,43.18 46.48,43.43 49.66,43.43 49.78,43.31 49.78,42.26 U1.20
CAN1_STBY  (via drill 0.4)
  Top 0.406: U2.15 29.55,36.15 28.96,35.56 v28.7,35.56 | U1.32 44.86,33.25 v44.83,33.27 | v40.64,35.56 v37.59,35.56
  Bottom 0.406: v44.83,33.27 44.83,34.42 43.69,35.56 v40.64,35.56 | v28.7,35.56 28.7,34.92 29.21,34.42 30.61,34.42 31.75,35.56 v37.59,35.56
CAN2_H
  Top 0.254: JP6.4 14.48,33.02
  Top 0.406: U3.13 29.56,21.81 28.19,20.45 27.5,20.45 R4.2 25.46,20.51 23.37,22.61 23.37,31.11 21.34,33.15 17.14,33.15 JP6.4
CAN2_INT  (via drill 0.4)
  Top 0.406: U3.25 38.23,23.11 38.86,22.48 v40.13,22.48 | U1.29 47.46,35.65 v48.01,36.2
  Bottom 0.406: v40.13,22.48 40.26,22.61 40.26,24.77 39.75,25.27 39.75,27.05 41.15,28.45 43.43,28.45 48.01,33.02 v48.01,36.2
CAN2_L  (via drill 0.4)
  Top 0.254: JP7.4 14.48,39.37
  Top 0.406: U3.12 27.48,22.46 R4.1 25.34,22.41 24.38,23.37 24.38,32.26 v21.46,35.18
  Bottom 0.406: v21.46,35.18 21.21,35.18 JP7.4
CAN2_RST  (via drill 0.4)
  Top 0.406: U3.2 34.45,26.83 34.92,27.3 41.27,27.3 44.83,30.86 v44.83,31.37 | U1.21 49,40.41 v49.02,40.39
  Bottom 0.406: v49.02,40.39 46.74,38.1 46.74,33.53 44.83,31.62 v44.83,31.37
CAN2_STBY  (via drill 0.4)
  Top 0.406: U3.15 31.2,20.15 v30.48,19.43 | v48.13,19.3 48.39,19.56 52.07,19.56 53.09,20.57 v52.96,20.57 | U1.5 58.97,35.65 59.56,35.05 v60.07,35.05
  Bottom 0.406: v30.48,19.43 30.48,18.92 31.24,18.16 32.64,18.16 33.53,19.05 47.88,19.05 v48.13,19.3 | v52.96,20.57 52.96,25.65 57.02,29.72 57.02,32 v60.07,35.05
CAN_CLK  (via drill 0.4)
  Top 0.406: U2.21 33.45,36.28 33.91,35.81 35.05,35.81 35.56,35.31 35.56,34.05 Y3.1 35.56,34.04 v37.15,32.45 U1.33 | U3.21 35.1,20.15 35.56,19.68 36.83,19.68 36.96,19.56 | 36.96,19.56 37.21,19.3 37.21,18.3 Y4.1 | 36.96,19.56 v36.96,19.81
  Bottom 0.406: v36.96,19.81 36.96,32.26 v37.15,32.45
CAN_H
  Top 0.406: X1.7 11.96,38.08 JP6.1 JP6.2
CAN_L
  Top 0.406: X1.2 14.4,39.45 JP7.2 JP7.1
D2/SDA/PC0  (via drill 0.4)
  Top 0.406: U1.10 59.08,39.65 v59.69,40.26 | IOH.9 21.34,49.02 22.61,47.75 v33.66,47.75 | v45.85,48.64 45.85,48.39 46.23,48.01 56.13,48.01 58.42,50.29 IOL.3
  Bottom 0.406: v59.69,40.26 59.69,47.88 58.42,49.15 IOL.3 | v33.66,47.75 34.16,48.26 45.47,48.26 v45.85,48.64
D3/SCL/PC1  (via drill 0.4)
  Top 0.406: U1.11 58,41.49 v58.04,41.53 | IOH.10 18.8,49.02 20.95,46.86 34.67,46.86 v34.67,46.99 | IOL.4 55.88,49.53 55.12,48.77 47.24,48.77 v46.99,49.02
  Bottom 0.406: v58.04,41.53 58.04,47.37 55.88,49.53 IOL.4 | v34.67,46.99 45.47,46.99 46.74,48.26 46.86,48.39 46.99,48.51 v46.99,49.02
D4/PD2  (via drill 0.4)
  Top 0.406: v46.86,42.55 47.9,42.55 U1.22
  Bottom 0.406: IOL.5 53.34,49.02 v46.86,42.55
D5/PD3  (via drill 0.4)
  Top 0.406: v45.85,41.78 45.85,41 U1.23
  Bottom 0.406: IOL.6 50.8,48.01 45.85,43.05 v45.85,41.78
D6/SS/PD4  (via drill 0.4)
  Top 0.406: U2.1 33.45,42.08 33.91,42.55 38.35,42.55 41.25,39.65 44.52,39.65 | U1.24 44.52,39.65 | 44.52,39.65 44.52,40.2 v44.58,40.26
  Bottom 0.406: IOL.7 48.26,47.37 44.58,43.69 v44.58,40.26
D7/PB2
  Top 0.406: U1.6 59.05,36.45 59.56,35.94 62.87,35.94 64.39,37.47 64.39,43.69 60.83,47.24 45.59,47.24 44.7,48.13 44.7,49.78 IOL.8
D8/PB3
  Top 0.406: IOH.1 41.66,47.24 42.42,46.48 60.58,46.48 63.5,43.56 63.5,37.72 62.61,36.83 59.94,36.83 59.52,37.25 U1.7
D9/SS/PC4  (via drill 0.4)
  Top 0.406: U3.1 35.1,26.08 35.43,26.42 v40.64,26.42 | v52.7,33.78 54.23,35.31 54.23,39.12 54.6,39.48 U1.14 54.61,42.26 54.61,44.45 53.34,45.72 41.4,45.72 39.12,48.01 IOH.2
  Bottom 0.406: v40.64,26.42 44.83,26.42 52.2,33.78 v52.7,33.78
D10/MOSI/PC5  (via drill 0.4)
  Top 0.406: v46.23,29.59 41.05,24.41 U3.27 | v50.29,33.27 53.47,36.45 53.47,39.62 53.8,39.95 U1.15 53.8,43.94 52.78,44.96 40.77,44.96 36.58,49.15 IOH.3
  Bottom 0.406: v50.29,33.27 49.91,33.27 v46.23,29.59
D11/MOSI/PD5  (via drill 0.4)
  Top 0.406: U1.25 40.15,38.85 v39.31,39.69 38.58,40.42 U2.27 | IOH.4 34.04,50.42 v39.5,44.96
  Bottom 0.406: v39.5,44.96 39.5,39.88 v39.31,39.69
D12/MISO/PD6  (via drill 0.4)
  Top 0.406: U2.28 35.86,41.07 v36.2,41.4 | U1.26 39.04,38.05 v38.86,38.23
  Bottom 0.406: v38.86,38.23 36.2,40.89 v36.2,41.4 36.07,41.53 36.07,44.07 31.5,48.64 IOH.5
D13/SCK/PD7  (via drill 0.4)
  Top 0.406: U1.27 38.57,37.25 37.34,38.48 | 37.34,38.48 36.07,39.75 34.16,39.75 U2.26 | 37.34,38.48 36.96,38.48 v36.83,38.35
  Bottom 0.406: IOH.6 28.96,49.66 35.18,43.43 35.18,40.01 v36.83,38.35
GND  (via drill 0.4, 0.6)
  Top 0.406: U3.18 33.15,19.05 32.64,18.54 32.26,18.54 31.75,18.03 31.75,17.59 C13.2 v30.1,17.27 | Y3.2 34.54,32.38 v34.42,32.26 | v29.21,32.38 29.21,33.34 C10.2 | C16.2 36.96,33.91 v36.83,34.04 36.7,34.16 36.7,35.81 35.35,37.17 U2.22 | v35.81,30.1 35.81,28.77 C14.1 | U2.18 31.5,35.56 30.35,34.42 30.35,34.35 C10.2 | C12.1 34.35,45.28 33.66,45.97 27.81,45.97 24.13,42.29 24.13,40.7 C11.1 v22.23,40.64 | U3.22 36.11,21.16 36.58,20.7 37.34,20.7 37.97,20.07 | 37.97,20.07 38.48,19.56 38.48,16.76 37.85,16.13 36.45,16.13 | 36.45,16.13 36.2,16.38 36.2,17.78 | 36.45,16.13 v35.43,16.13 | U$1.P$1 49.28,22.86 49.28,23.97 | 49.28,23.97 49.28,24.64 | 49.28,24.64 Y1.2 | U1.18 51.4,37.76 v51.56,37.59 | U1.30 47.93,34.85 49.28,36.2 v49.28,37.59 | v55.75,37.47 56.34,38.05 U1.8 C7.2 62.04,38.04 v62.48,38.48 | ICSP.6 66.17,21.11 J3.6 | J3.6 J3.7 60.58,20.39 J3.1 58.67,18.03 58.17,18.54 Y2.2 | 52.58,24.32 C17.2 | U1.38 51.4,27.65 51.18,27.43 51.18,24.13 51.24,23.97 | C17.2 C2.2 57.15,23.97 LED1.C 61.31,26.89 v61.34,26.92 | C17.2 51.24,23.97 | 51.24,23.97 49.28,23.97 | J3.6 J3.9 J3.8 60.83,12.01 60.83,9.78 59.12,8.07 50.61,8.07 | 50.61,8.07 C9.2 43.18,7.18 PWR.7 | 50.61,8.07 51.44,8.89 51.44,9.75 U4.1 | 19.34,4.7 12.32,4.7 11.18,3.56 8.92,3.56 J1.2 | X1.3 11.05,36.7 12.7,35.05 12.7,31.5 13.72,30.48 18.94,30.48 C3.- 20.97,28.72 v22.23,29.97 | IC2.1 22.07,23.85 v22.1,23.88 | 25.91,24.57 v25.91,26.04 | C10.2 25.32,33.81 v25.15,34.04 | 20.45,13.84 v22.35,13.84 22.99,13.84 | 22.99,13.84 25.27,13.84 | 25.27,13.84 27.43,13.84 v27.94,13.34 29.34,11.94 C6.2 | C5.- 25.15,13.72 25.27,13.84 | C8.2 23.24,14.1 22.99,13.84 | 37.97,20.07 37.97,20.19 v38.1,20.32
  Top 0.406: 49.28,24.64 v48.39,24.64 | v12.83,13.72 12.83,15.55 C4.2
  Top 0.61: v21.46,5.46 20.29,5.46 PW_LED.C
  Top 0.813: J1.1 5.89,6.58 J1.2 | IC2.1 20.42,27.9 C3.-
  Bottom 0.406: v29.21,32.38 29.34,32.26 v34.42,32.26 35.81,32.26 | v36.83,34.04 36.83,33.27 35.81,32.26 | 35.81,32.26 v35.81,30.1 | IOH.7 26.42,46.35 22.23,42.16 v22.23,40.64 25.15,37.72 v25.15,34.04 22.23,31.11 v22.23,29.97 | v35.43,16.13 31.24,16.13 v30.1,17.27 30.1,15.62 27.94,13.46 v27.94,13.34 | v49.28,37.59 v51.56,37.59 55.63,37.59 v55.75,37.47 | v62.48,38.48 62.48,33.78 64.9,31.37 64.9,26.67 ICSP.6 64.14,23.37 62.48,23.37 61.59,24.26 61.59,26.67 v61.34,26.92 | J1.1 5.89,8.94 10.67,13.72 v12.83,13.72 | v12.83,13.72 22.23,13.72 v22.35,13.84 | v12.83,13.72 12.57,13.97 12.57,35.18 11.05,36.7 X1.3 | v22.1,23.88 23.75,23.88 v25.91,26.04 | v38.1,20.32 39.75,20.32 43.56,24.13 47.88,24.13 v48.39,24.64
  Bottom 0.61: 39.62,5.84 21.84,5.84 v21.46,5.46
  Bottom 0.813: PWR.7 PWR.6 40.64,4.83 39.62,5.84
  other vias: 15.37,45.85 12.32,29.34 48.26,6.6 65.41,16.64 41.91,41.66 40.26,29.72 43.56,24.77 48.13,15.88 43.94,11.68
  pour Top (isolate 0.254): 0,0 0,53.34 67.69,53.34 68.45,53.34 68.45,1.27 68.45,0
  pour Bottom (isolate 0.254): 0,0 0,53.34 67.69,53.34 68.45,53.34 68.45,1.27 68.45,0
MISO/PC6
  Top 0.406: U3.28 40.56,25.06 46.58,31.14 46.63,31.14 46.74,31.14 52.58,36.98 52.58,37.08 52.58,39.88 53,40.3 U1.16
N$1
  Top 0.406: U1.36 49.8,29.22 49.02,28.45 48.51,28.45 48.26,28.19 48.26,26.81 Y1.3
N$2
  Top 0.406: U1.37 50.6,28.25 50.28,27.92 Y1.1
N$3
  Top 0.406: U4.13 C1.2
N$4
  Top 0.813: IC2.3 14.2,23.85 9.46,19.12 C4.1 9.34,16.89 D1.3
N$5
  Top 0.406: J3.3 54.91,16.43 53.34,14.86 U4.5
N$6  (via drill 0.4)
  Top 0.406: U3.16 31.85,19.46 v31.88,19.43 | U3.4 33.15,26.92 v32.26,27.81
  Bottom 0.406: v31.88,19.43 31.88,27.43 v32.26,27.81
N$7
  Top 0.406: R1.1 19.66,2.73 PW_LED.A
N$8  (via drill 0.4)
  Top 0.406: J3.4 60.57,15.62 56.01,15.62 v55.24,14.86 | U4.6 52.83,16.13 v53.09,16.38
  Bottom 0.406: v55.24,14.86 54.61,14.86 v53.09,16.38
N$9  (via drill 0.4)
  Top 0.406: U2.4 31.5,42.93 v31.11,43.31 | U2.16 30.2,35.4 v30.1,35.43
  Bottom 0.406: v31.11,43.31 30.1,42.29 v30.1,35.43
N$10
  Top 0.406: U2.10 28.05,39.77 27.56,40.26 27.56,42.04 28.32,42.8 30.48,42.8 30.85,42.43 U2.5
N$11
  Top 0.406: LED1.A 60.07,30.8 R5.1
N$12
  Top 0.406: U3.5 32.5,26.43 32.13,26.8 29.84,26.8 29.21,26.16 29.21,24.38 29.83,23.76 U3.10
N$13
  Top 0.406: SJ1.2 40.77,13.65 C1.1
N$14
  Top 0.406: 55.1,19.94 Y2.1 54.47,19.56 53.47,19.56 52.58,18.67 U4.8
N$15
  Top 0.406: U4.7 53.09,17.4 53.21,17.53 54.47,17.53 Y2.3
N$16
  Top 0.406: U2.20 32.8,35.4 33.66,34.54 33.66,34.15 Y3.3
N$17
  Top 0.406: U3.20 34.45,19.53 35.31,18.67 35.31,18.4 Y4.3
N$18
  Top 0.406: 61.71,34.85 R5.2 61.28,34.16 59.56,34.16 58.88,34.85 U1.4
PDI_CLK/RST  (via drill 0.4)
  Top 0.406: PWR.3 v33.02,8.38 | v43.69,16.26 SJ1.1 42.29,18.35 R2.1 42.61,20.44 | 42.61,20.44 42.61,21.52 U$1.P$2 41.78,22.36 | U1.35 49,29.57 48.64,29.21 48.03,29.21 46.71,27.89 46.71,20.77 46.48,20.44 | 42.61,20.44 46.48,20.44 | 46.48,20.44 51.43,20.44 52.45,21.46 57.66,21.46 59.05,22.86 61.09,22.86 ICSP.5
  Bottom 0.406: v33.02,8.38 33.02,14.73 33.53,15.24 42.67,15.24 v43.69,16.26
PDI_DATA  (via drill 0.4)
  Top 0.406: U1.34 48.2,30.44 45.59,27.84 v45.59,21.46 | ICSP.1 62.87,30.48 62.23,29.84 62.23,25.4 60.71,23.88 58.29,23.88 56.9,22.48 52.32,22.48 51.18,21.34 47.75,21.34 v47.62,21.46
  Bottom 0.406: v47.62,21.46 v45.59,21.46
RX/PC2  (via drill 0.4)
  Top 0.406: v61.59,42.8 57.4,42.8 56.85,42.25 U1.12 56.2,40.83 v56.39,40.64 56.26,40.64 | U4.2 52.45,11.05 53.09,11.68 v53.09,11.94
  Bottom 0.406: v61.59,42.8 63.5,44.7 IOL.1 | v53.09,11.94 52.96,11.94 51.56,13.34 51.56,29.72 57.78,35.94 57.78,39.24 v56.39,40.64
SCK/PC7  (via drill 0.4)
  Top 0.406: U1.17 v52.2,43.69 | U3.26 39.23,23.76 v39.5,23.5
  Bottom 0.406: v39.5,23.5 38.86,24.13 38.86,35.31 40.39,36.83 43.81,36.83 49.53,42.55 51.69,42.55 52.2,43.05 v52.2,43.69
TX/PC3  (via drill 0.4)
  Top 0.406: v60.96,43.81 55.75,43.81 55.4,43.46 U1.13 55.4,40.11 v55.5,40.01 | U4.3 50.16,12.32 v49.78,12.7
  Bottom 0.406: v60.96,43.81 IOL.2 | v49.78,12.7 49.78,29.34 56.77,36.32 56.77,38.73 v55.5,40.01
VIN
  Top 0.813: D1.2 3.47,13.67 4.57,12.57 7.7,12.57 J1.3
  Bottom 0.813: 11.89,7.92 J1.3 13.16,7.11 42.93,7.11 45.72,4.32 PWR.8
VOBD
  Top 0.813: D1.1 3.47,29.33 X1.9
VUSB  (via drill 0.4, 0.6)
  Top 0.406: J3.5 59.16,14.83 58.67,14.35
  Top 0.61: 58.42,14.1 58.67,14.35
  Top 0.813: v53.85,9.53 58.42,14.1 | v37.47,11.68 37.42,11.73 D2.2 D2.1
  Bottom 0.813: v53.85,9.53 38.48,9.53 37.47,10.54 v37.47,11.68

### Text on the board
tPlace: SCL | SDA | AREF | GND | D13 | D12 | D11 | D10 | D9 | D8 | D7 | D6 | D5 | D4 | D3 | D2 | TX | RX | CAN L | CAN H | uC / VCC | RST | IOref | RST | 3V3 | 5V | GND | GND | Vin | A0 | A1 | A2 | A3 | A4 | A5
bPlace: https://rhme.riscure.com